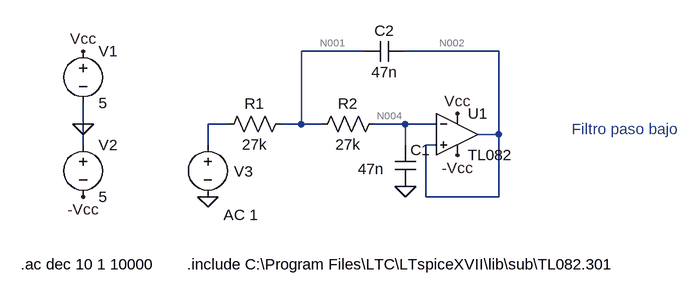
[diagram p0: schematic Filtro paso bajo.asc]
Filtro paso bajo.asc, the LTspice schematic file:
Version 4
SHEET 1 880 680
WIRE 112 16 16 16
WIRE 320 16 176 16
WIRE -320 128 -320 96
WIRE -96 128 -128 128
WIRE 16 128 16 16
WIRE 16 128 -16 128
WIRE 48 128 16 128
WIRE 176 128 128 128
WIRE 224 128 176 128
WIRE 320 144 320 16
WIRE 320 144 288 144
WIRE -320 160 -320 128
WIRE -128 160 -128 128
WIRE 176 160 176 128
WIRE 224 160 208 160
WIRE 208 240 208 160
WIRE 320 240 320 144
WIRE 320 240 208 240
FLAG -320 128 0
FLAG -320 16 Vcc
FLAG -320 240 -Vcc
FLAG 256 112 Vcc
FLAG 256 176 -Vcc
FLAG -128 240 0
FLAG 176 224 0
SYMBOL Opamps\\opamp2 256 80 R0
SYMATTR InstName U1
SYMATTR Value TL082
SYMBOL voltage -320 0 R0
WINDOW 123 0 0 Left 0
WINDOW 39 0 0 Left 0
SYMATTR InstName V1
SYMATTR Value 5
SYMBOL voltage -320 144 R0
WINDOW 123 0 0 Left 0
WINDOW 39 0 0 Left 0
SYMATTR InstName V2
SYMATTR Value 5
SYMBOL voltage -128 144 R0
WINDOW 123 24 124 Left 2
WINDOW 39 0 0 Left 0
WINDOW 0 40 57 Left 2
SYMATTR Value2 AC 1
SYMATTR InstName V3
SYMATTR Value ""
SYMBOL res 0 112 R90
WINDOW 0 0 56 VBottom 2
WINDOW 3 32 56 VTop 2
SYMATTR InstName R1
SYMATTR Value 27k
SYMBOL res 144 112 R90
WINDOW 0 0 56 VBottom 2
WINDOW 3 32 56 VTop 2
SYMATTR InstName R2
SYMATTR Value 27k
SYMBOL cap 160 160 R0
WINDOW 3 -57 37 Left 2
SYMATTR Value 47n
SYMATTR InstName C1
SYMBOL cap 176 0 R90
WINDOW 0 0 32 VBottom 2
WINDOW 3 32 32 VTop 2
SYMATTR InstName C2
SYMATTR Value 47n
TEXT -160 344 Left 2 !.include C:\\Program Files\\LTC\\LTspiceXVII\\lib\\sub\\TL082.301
TEXT -416 344 Left 2 !.ac dec 10 1 10000
TEXT 432 136 Left 2 ;Filtro paso bajo

The netlist it stands for:
* Filtro paso bajo.asc
XU1 N002 N004 Vcc -Vcc N002 TL082  ; pins In+ In- V+ V- OUT
V1 Vcc 0 5
V2 0 -Vcc 5
V3 N003 0 AC 1
R1 N001 N003 27k
R2 N004 N001 27k
C1 N004 0 47n
C2 N002 N001 47n
.include C:\Program Files\LTC\LTspiceXVII\lib\sub\TL082.301
.ac dec 10 1 10000
* Filtro paso bajo
.backanno
.end

* Results of the author's LTspice run, read from the files saved beside the schematic
* Operating Point, zero values left out:
*   V(n002) = -3.477 V
*   V(-vcc) = -5 V
*   V(vcc) = 5 V
*   V(n004) = -2.084 µV
*   V(n001) = -1.042 µV
*   I(R2) = -38.6 pA
*   I(R1) = -38.6 pA
*   I(V3) = -38.6 pA
*   I(V2) = -4.678 mA
*   I(V1) = -4.861 mA
*   Ix(u1:1) = 30.82 pA
*   Ix(u1:2) = 38.6 pA
*   Ix(u1:3) = 4.861 mA
*   Ix(u1:4) = -4.678 mA
*   Ix(u1:5) = -31.15 pA
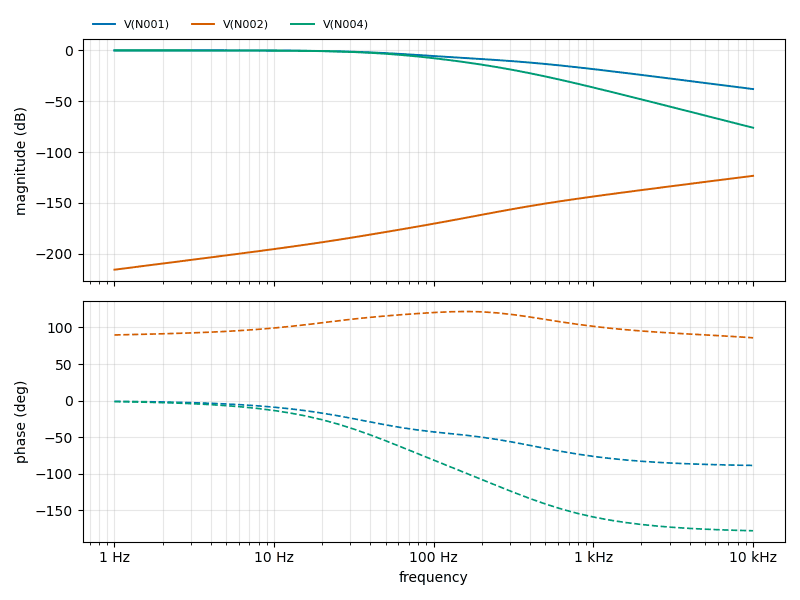
[diagram p1: AC Analysis of Filtro paso bajo.asc, plotted from the saved traces]
* AC Analysis, 1 run:
*   V(N001): -0.00 dB at 1 Hz, -38.04 dB at 10 kHz, peak -0.00 dB at 1 Hz, 3 dB below the peak at 54.85 Hz
*   V(N002): -215.70 dB at 1 Hz, -123.36 dB at 10 kHz, peak -123.36 dB at 10 kHz, 3 dB below the peak at 7.059 kHz
*   V(N004): -0.00 dB at 1 Hz, -76.07 dB at 10 kHz, peak -0.00 dB at 1 Hz, 3 dB below the peak at 46.68 Hz